# EAGLE schematic ADSR1 (EAGLE 7.1.0)
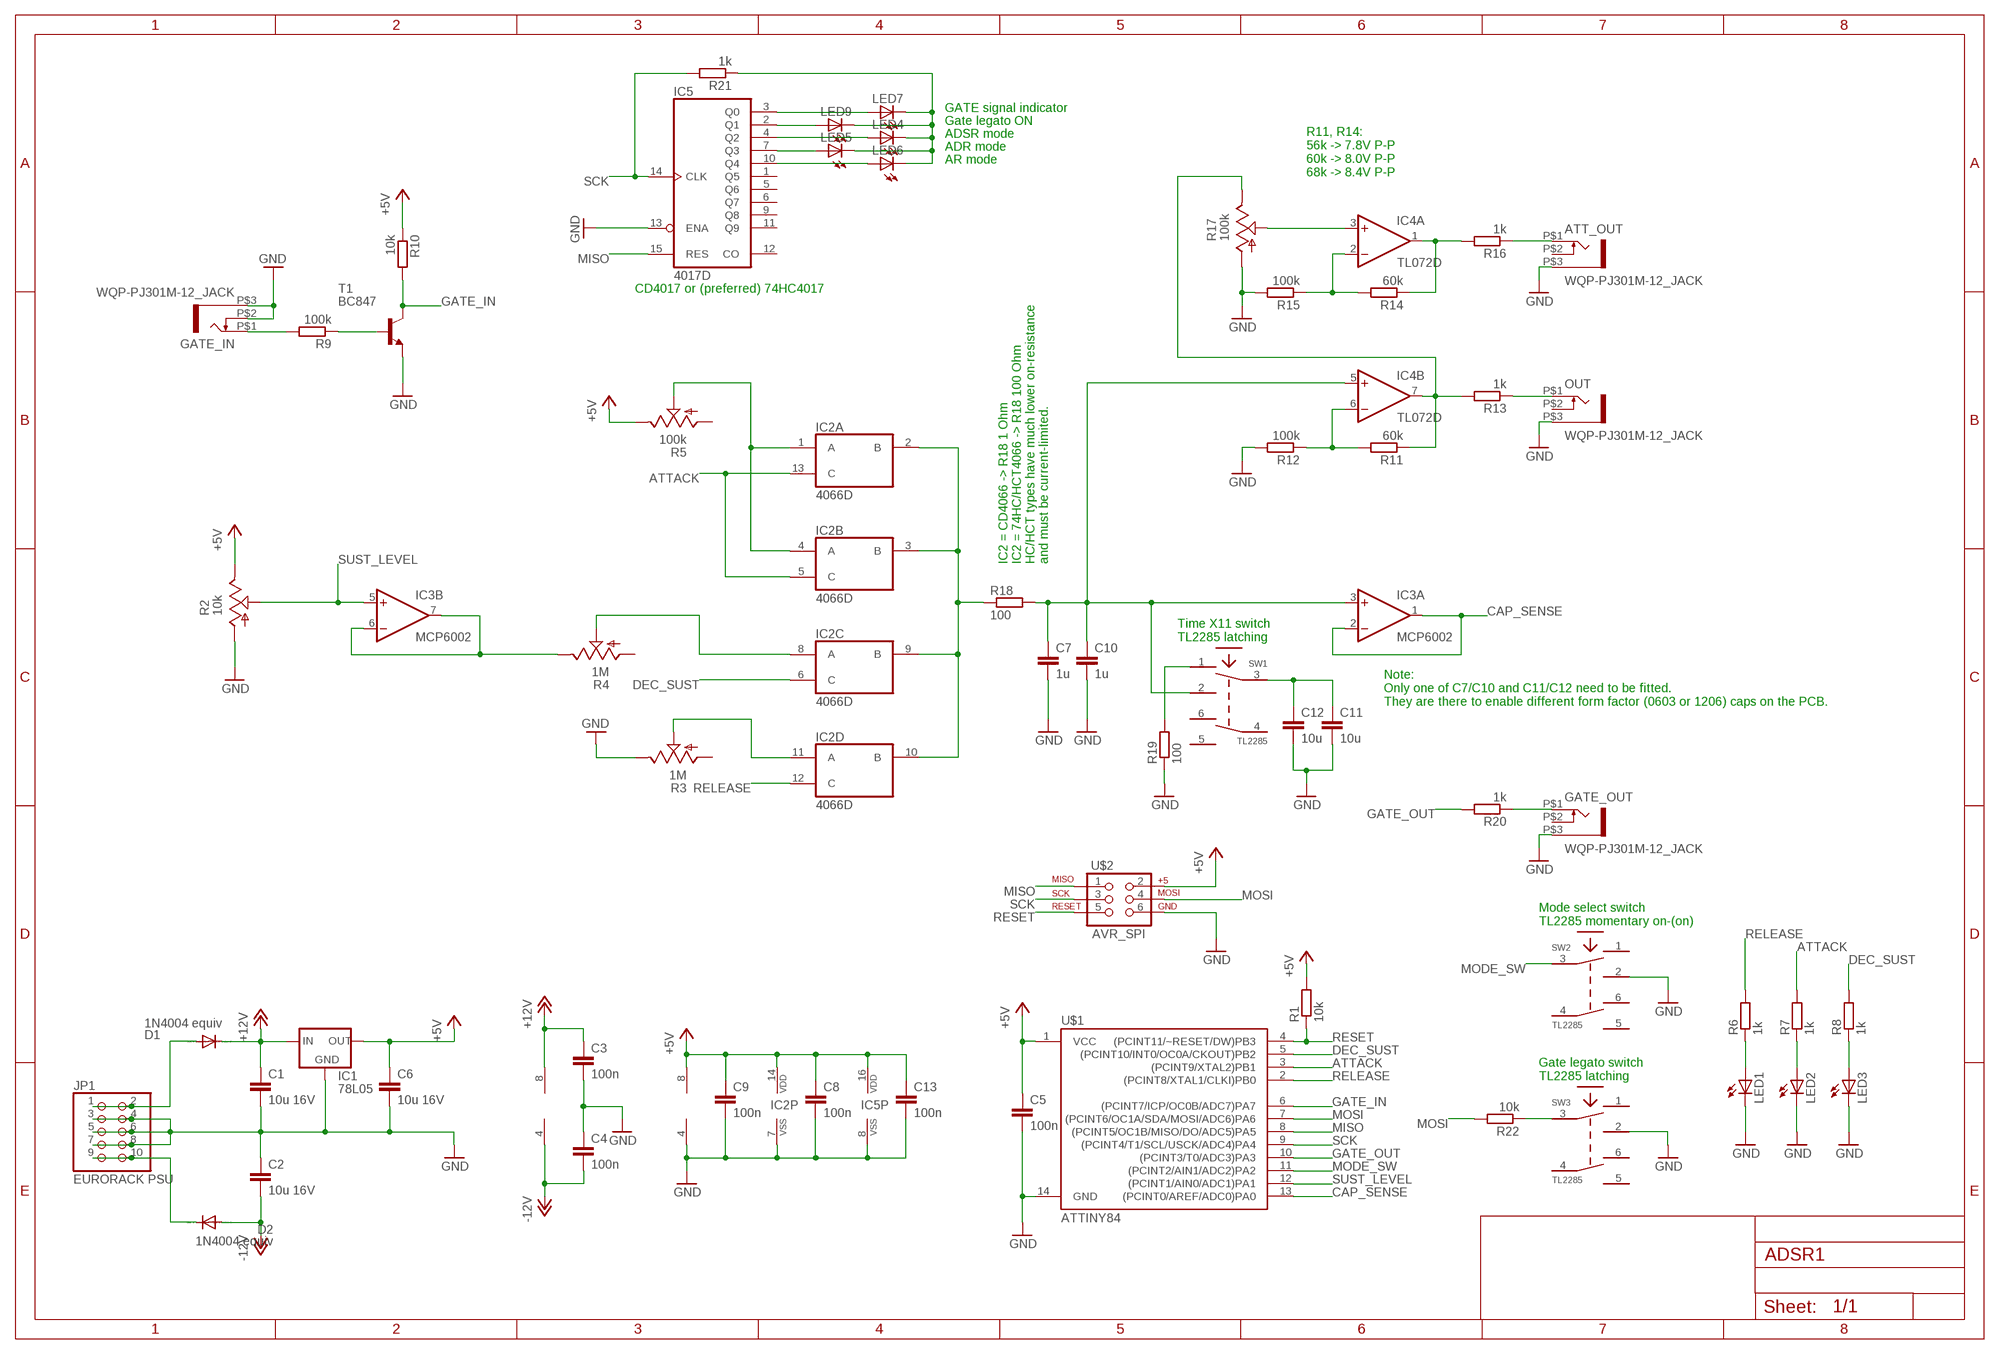
[diagram p0: schematic, sheet 1]

## Parts
ATT_OUT  WQP-PJ301M-12_JACK  [WQP-PJ301M-12_JACK]
C1  10u 16V  C-EUC1206K  [C1206K]
C2  10u 16V  C-EUC1206K  [C1206K]
C3  100n  C-EUC0603K  [C0603K]
C4  100n  C-EUC0603K  [C0603K]
C5  100n  C-EUC0603K  [C0603K]
C6  10u 16V  C-EUC1206K  [C1206K]
C7  1u  C-EUC0603K  [C0603K]
C8  100n  C-EUC0603K  [C0603K]
C9  100n  C-EUC0603K  [C0603K]
C10  1u  C-EUC1206K  [C1206K]
C11  10u  C-EUC1206K  [C1206K]
C12  10u  C-EUC0603K  [C0603K]
C13  100n  C-EUC0603K  [C0603K]
D1  1N4004 equiv  DIODE-DO214AA  [DO214AA]
D2  1N4004 equiv  DIODE-DO214AA  [DO214AA]
GATE_IN  WQP-PJ301M-12_JACK  [WQP-PJ301M-12_JACK]
GATE_OUT  WQP-PJ301M-12_JACK  [WQP-PJ301M-12_JACK]
IC1  78L05  78LXXSMD  [SOT89R]
IC2  4066D  [SO14]
IC3  MCP6002  TL072D  [SO08]
IC4  TL072D  [SO08]
IC5  4017D  [SO16]
JP1  EURORACK PSU  PINHD-2X5  [2X05]
LED1  LED3MM  [LED3MM]
LED2  LED3MM  [LED3MM]
LED3  LED3MM  [LED3MM]
LED4  LED3MM  [LED3MM]
LED5  LED3MM  [LED3MM]
LED6  LED3MM  [LED3MM]
LED7  LED3MM  [LED3MM]
LED9  LED3MM  [LED3MM]
OUT  WQP-PJ301M-12_JACK  [WQP-PJ301M-12_JACK]
R1  10k  R-EU_R0603  [R0603]
R2  10k  POT_USVERTICAL  [ALPS_POT_VERTICAL]
R3  1M  POT_USVERTICAL  [ALPS_POT_VERTICAL]
R4  1M  POT_USVERTICAL  [ALPS_POT_VERTICAL]
R5  100k  POT_USVERTICAL  [ALPS_POT_VERTICAL]
R6  1k  R-EU_R0603  [R0603]
R7  1k  R-EU_R0603  [R0603]
R8  1k  R-EU_R0603  [R0603]
R9  100k  R-EU_R0603  [R0603]
R10  10k  R-EU_R0603  [R0603]
R11  60k  R-EU_R0603  [R0603]
R12  100k  R-EU_R0603  [R0603]
R13  1k  R-EU_R0603  [R0603]
R14  60k  R-EU_R0603  [R0603]
R15  100k  R-EU_R0603  [R0603]
R16  1k  R-EU_R0603  [R0603]
R17  100k  POT_USVERTICAL  [ALPS_POT_VERTICAL]
R18  100  R-EU_R1206  [R1206]
R19  100  R-EU_R1206  [R1206]
R20  1k  R-EU_R0603  [R0603]
R21  1k  R-EU_R0603  [R0603]
R22  10k  R-EU_R0603  [R0603]
SW1  TL2285  [TL2285_PCB]
SW2  TL2285  [TL2285_PCB]
SW3  TL2285  [TL2285_PCB]
T1  BC847  [SOT23]
U$1  ATTINY84  [SO14]
U$2  AVR_SPI  AVR_SPI_PRG_6PTH  [2X3]

## Nets
+5V: C5.1 C6.1 C8.1 C9.1 C13.1 IC1.PAD1(OUT) IC2.14(P:VDD) IC3.8(P:V+) IC5.16(VDD) R1.2 R2.P$1(E) R5.P$1(E) R10.1 U$1.1(VCC) U$2.2
+12V: C1.1 C3.1 D1.C IC1.PAD3(IN) IC4.8(P:V+)
-12V: C2.2 C4.2 D2.A IC4.4(P:V-)
ATTACK: IC2.5(B:C) IC2.13(A:C) R7.2 U$1.3((PCINT9/XTAL2)PB1)
CAP_SENSE: IC3.1(A:OUT) IC3.2(A:-IN) U$1.13((PCINT0/AREF/ADC0)PA0)
DEC_SUST: IC2.6(C:C) R8.2 U$1.5((PCINT10/INT0/OC0A/CKOUT)PB2)
GATE_IN: R10.2 T1.3(C) U$1.6((PCINT7/ICP/OC0B/ADC7)PA7)
GATE_OUT: R20.2 U$1.10((PCINT3/T0/ADC3)PA3)
GND: ATT_OUT.P$3 C1.2 C2.1 C3.2 C4.1 C5.2 C6.2 C7.2 C8.2 C9.2 C10.2 C11.2 C12.2 C13.2 GATE_IN.P$2 GATE_IN.P$3 GATE_OUT.P$3 IC1.PAD2(GND) IC1.PAD4(GND) IC2.7(P:VSS) IC3.4(P:V-) IC5.8(VSS) IC5.13(ENA) JP1.3 JP1.4 JP1.5 JP1.6 JP1.7 JP1.8 LED1.K(C) LED2.K(C) LED3.K(C) OUT.P$3 R2.P$3(A) R3.P$1(E) R12.2 R15.2 R17.P$3(A) R19.1 SW2.2 SW3.2 T1.2(E) U$1.14(GND) U$2.6
MISO: IC5.15(RES) U$1.8((PCINT5/OC1B/MISO/DO/ADC5)PA5) U$2.1
MODE_SW: SW2.3 U$1.11((PCINT2/AIN1/ADC2)PA2)
MOSI: R22.2 U$1.7((PCINT6/OC1A/SDA/MOSI/ADC6)PA6) U$2.4
N$1: C7.1 C10.1 IC3.3(A:+IN) IC4.5(B:+IN) R18.2 SW1.2
N$2: GATE_IN.P$1 R9.2
N$3: D1.A JP1.1 JP1.2
N$4: LED3.A R8.1
N$5: IC2.11(D:A) R3.P$2(S)
N$6: IC2.8(C:A) R4.P$2(S)
N$7: IC3.6(B:-IN) IC3.7(B:OUT) R4.P$1(E)
N$8: LED2.A R7.1
N$9: LED1.A R6.1
N$10: IC2.1(A:A) IC2.4(B:A) R5.P$2(S)
N$11: OUT.P$1 R13.1
N$12: IC4.6(B:-IN) R11.2 R12.1
N$13: R9.1 T1.1(B)
N$14: D2.C JP1.9 JP1.10
N$15: IC4.7(B:OUT) R11.1 R13.2 R17.P$1(E)
N$16: C11.1 C12.1 SW1.3
N$17: IC2.2(A:B) IC2.3(B:B) IC2.9(C:B) IC2.10(D:B) R18.1
N$18: R19.2 SW1.1
N$19: ATT_OUT.P$1 R16.1
N$20: IC4.1(A:OUT) R14.1 R16.2
N$21: IC4.2(A:-IN) R14.2 R15.1
N$22: IC5.2(Q1) LED9.A
N$23: GATE_OUT.P$1 R20.1
N$24: IC4.3(A:+IN) R17.P$2(S)
N$25: IC5.4(Q2) LED4.A
N$26: IC5.7(Q3) LED5.A
N$27: IC5.10(Q4) LED6.A
N$28: LED4.K(C) LED5.K(C) LED6.K(C) LED7.K(C) LED9.K(C) R21.1
N$29: IC5.3(Q0) LED7.A
N$30: R22.1 SW3.3
RELEASE: IC2.12(D:C) R6.2 U$1.2((PCINT8/XTAL1/CLKI)PB0)
RESET: R1.1 U$1.4((PCINT11/~RESET/DW)PB3) U$2.5
SCK: IC5.14(CLK) R21.2 U$1.9((PCINT4/T1/SCL/USCK/ADC4)PA4) U$2.3
SUST_LEVEL: IC3.5(B:+IN) R2.P$2(S) U$1.12((PCINT1/AIN0/ADC1)PA1)
Unconnected: ATT_OUT.P$2 GATE_OUT.P$2 IC5.1(Q5) IC5.5(Q6) IC5.6(Q7) IC5.9(Q8) IC5.11(Q9) IC5.12(CO) OUT.P$2 R3.P$3(A) R4.P$3(A) R5.P$3(A) SW1.4 SW1.5 SW1.6 SW2.1 SW2.4 SW2.5 SW2.6 SW3.1 SW3.4 SW3.5 SW3.6

## Notes on the sheet
- GATE signal indicator
- Gate legato ON
- ADSR mode
- ADR mode
- AR mode
- R11, R14:
  56k -> 7.8V P-P
  60k -> 8.0V P-P
  68k -> 8.4V P-P
- CD4017 or (preferred) 74HC4017
- IC2 = CD4066 -> R18 1 Ohm
  IC2 = 74HC/HCT4066 -> R18 100 Ohm
  HC/HCT types have much lower on-resistance
  and must be current-limited.
- Time X11 switch
  TL2285 latching
- Note:
  Only one of C7/C10 and C11/C12 need to be fitted.
  They are there to enable different form factor (0603 or 1206) caps on the PCB.
- Mode select switch
  TL2285 momentary on-(on)
- Gate legato switch
  TL2285 latching

## Library data of the parts
ATT_OUT GATE_IN GATE_OUT OUT = thonkiconn:WQP-PJ301M-12_JACK
C1-C13 = rcl:C-EU: CAPACITOR, European symbol
D1 D2 = diode:DIODE-: DIODE
IC1 = lb_devs:78LXX: 78LXX SMD voltage regulator
IC2 = 40xx:4066: Quad bilateral ANALOG SWITCH
IC3 IC4 = linear:TL072: OP AMP
IC5 = 40xx:4017: COUNTER/DIVIDER
JP1 = pinhead:PINHD-2X5: PIN HEADER
LED1-LED7 LED9 = led:LED: LED OSRAM: - CHIPLED LG R971, LG N971, LY N971, LG Q971, LY Q971, LO R971, LY R971 LH N974, LH R974 LS Q976, LO Q976, LY Q976 LO Q996 - Hyper CHIPLED LW Q18S LB Q993, LB Q99A, LB R99A - SideLED LS A670, LO A670, LY A670, LG A670, LP A670 LB A673, LV A673, LT A673, LW A673 LH A674 LY A675 LS A676, LA A676, LO A676, LY A676, LW A676 LS A679, LY A679, LG A679 - Hyper Micro SIDELED® LS Y876, LA Y876, LO Y876, LY Y876 LT Y87S - SmartLED LW L88C, LW L88S LB L89C, LB L89S, LG L890 LS L89K, LO L89K, LY L89K LS L896, LA L896, LO L896, LY L896 - TOPLED LS T670, LO T670, LY T670, LG T670, LP T670 LSG T670, LSP T670, LSY T670, LOP T670, LYG T670 LG T671, LOG T671, LSG T671 LB T673, LV T673, LT T673, LW T673 LH T674 LS T676, LA T676, LO T676, LY T676, LB T676, LH T676, LSB T676, LW T676 LB T67C, LV T67C, LT T67C, LS T67K, LO T67K, LY T67K, LW E67C LS E67B, LA E67B, LO E67B, LY E67B, LB E67C, LV E67C, LT E67C LW T67C LS T679, LY T679, LG T679 LS T770, LO T770, LY T770, LG T770, LP T770 LB T773, LV T773, LT T773, LW T773 LH T774 LS E675, LA E675, LY E675, LS T675 LS T776, LA T776, LO T776, LY T776, LB T776 LHGB T686 LT T68C, LB T68C - Hyper Mini TOPLED® LB M676 - Mini TOPLED Santana® LG M470 LS M47K, LO M47K, LY M47K Source: http://www.osram.convergy.de LUXEON: - LUMILED® LXK2-PW12-R00, LXK2-PW12-S00, LXK2-PW14-U00, LXK2-PW14-V00 LXK2-PM12-R00, LXK2-PM12-S00, LXK2-PM14-U00 LXK2-PE12-Q00, LXK2-PE12-R00, LXK2-PE12-S00, LXK2-PE14-T00, LXK2-PE14-U00 LXK2-PB12-K00, LXK2-PB12-L00, LXK2-PB12-M00, LXK2-PB14-N00, LXK2-PB14-P00, LXK2-PB14-Q00 LXK2-PR12-L00, LXK2-PR12-M00, LXK2-PR14-Q00, LXK2-PR14-R00 LXK2-PD12-Q00, LXK2-PD12-R00, LXK2-PD12-S00 LXK2-PH12-R00, LXK2-PH12-S00 LXK2-PL12-P00, LXK2-PL12-Q00, LXK2-PL12-R00 Source: www.luxeon.com KINGBRIGHT: KA-3528ASYC Source: www.kingbright.com
R1 R6-R16 R18-R22 = rcl:R-EU_: RESISTOR, European symbol
R2-R5 R17 = pot-alps:POT_US
SW1-SW3 = lb_devs:TL2285: E-Switch TL2285 (PCB switch)
T1 = transistor:BC847: NPN TRANSISTOR
U$1 = SparkFun-DigitalIC:ATTINY84: Atmel 14-pin 2/4/8kB flash uC
U$2 = SparkFun:AVR_SPI_PRG_6: AVR ISP 6 Pin This is the reduced ISP connector for AVR programming. Common on Arduino. This footprint will take up less PCB space and can be used with a 10-pin to 6-pin adapter such as SKU: BOB-08508